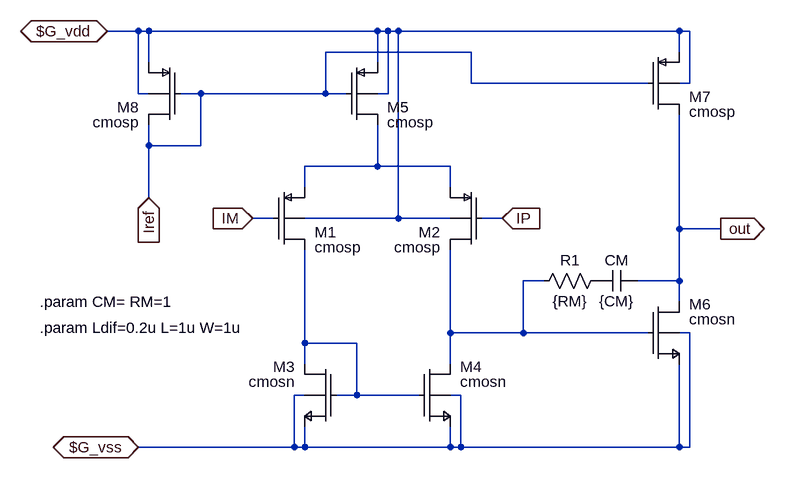
[diagram p0: schematic ao_miler_p.asc]
ao_miler_p.asc, the LTspice schematic file:
Version 4
SHEET 1 880 892
WIRE -400 192 -448 192
WIRE -384 192 -400 192
WIRE -32 192 -384 192
WIRE -16 192 -32 192
WIRE 0 192 -16 192
WIRE 432 192 0 192
WIRE 448 192 432 192
WIRE 112 224 -112 224
WIRE 432 224 432 192
WIRE -384 240 -384 192
WIRE -32 240 -32 192
WIRE 112 272 112 224
WIRE 384 272 112 272
WIRE 448 272 448 192
WIRE 448 272 432 272
WIRE -400 288 -400 192
WIRE -384 288 -400 288
WIRE -304 288 -336 288
WIRE -112 288 -112 224
WIRE -112 288 -304 288
WIRE -80 288 -112 288
WIRE -16 288 -16 192
WIRE -16 288 -32 288
WIRE -384 368 -384 336
WIRE -304 368 -304 288
WIRE -304 368 -384 368
WIRE -32 400 -32 336
WIRE -32 400 -144 400
WIRE 80 400 -32 400
WIRE -144 432 -144 400
WIRE 80 432 80 400
WIRE -384 448 -384 368
WIRE -192 480 -224 480
WIRE 0 480 0 192
WIRE 0 480 -144 480
WIRE 80 480 0 480
WIRE 160 480 128 480
WIRE 432 496 432 320
WIRE 496 496 432 496
WIRE 224 576 192 576
WIRE 432 576 432 496
WIRE 432 576 368 576
WIRE 432 608 432 576
WIRE 80 656 80 528
WIRE 192 656 192 576
WIRE 192 656 80 656
WIRE 384 656 192 656
WIRE 448 656 432 656
WIRE -144 672 -144 528
WIRE -64 672 -144 672
WIRE -144 704 -144 672
WIRE 80 704 80 656
WIRE -144 752 -160 752
WIRE -64 752 -64 672
WIRE -64 752 -96 752
WIRE 32 752 -64 752
WIRE 96 752 80 752
WIRE -160 832 -160 752
WIRE -160 832 -400 832
WIRE -144 832 -144 800
WIRE -144 832 -160 832
WIRE 80 832 80 800
WIRE 80 832 -144 832
WIRE 96 832 96 752
WIRE 96 832 80 832
WIRE 432 832 432 704
WIRE 432 832 96 832
WIRE 448 832 448 656
WIRE 448 832 432 832
FLAG 160 480 IP
IOPIN 160 480 In
FLAG -224 480 IM
IOPIN -224 480 In
FLAG 496 496 out
IOPIN 496 496 Out
FLAG -384 448 Iref
IOPIN -384 448 In
FLAG -400 832 $G_vss
IOPIN -400 832 BiDir
FLAG -448 192 $G_vdd
IOPIN -448 192 BiDir
SYMBOL cap 368 560 R90
WINDOW 0 0 32 VBottom 2
WINDOW 3 32 32 VTop 2
SYMATTR InstName CM
SYMATTR Value {CM}
SYMBOL res 320 560 R90
WINDOW 0 0 56 VBottom 2
WINDOW 3 32 56 VTop 2
SYMATTR InstName R1
SYMATTR Value {RM}
SYMBOL nmosb 384 608 R0
SYMATTR InstName M6
SYMATTR Value cmosn
SYMATTR Value2 l={L} w={W} ad={Ldif*W} as={Ldif*W} pd={(Ldif+W)*2} ps={(Ldif+W)*2} m=1
SYMBOL pmosb 384 224 R0
SYMATTR InstName M7
SYMATTR Value cmosp
SYMATTR Value2 l={L} w={W} ad={Ldif*W} as={Ldif*W} pd={(Ldif+W)*2} ps={(Ldif+W)*2} m=1
SYMBOL pmosb -192 432 R0
SYMATTR InstName M1
SYMATTR Value cmosp
SYMATTR Value2 l={L} w={W} ad={Ldif*W} as={Ldif*W} pd={(Ldif+W)*2} ps={(Ldif+W)*2} m=1
SYMBOL pmosb 128 432 M0
SYMATTR InstName M2
SYMATTR Value cmosp
SYMATTR Value2 l={L} w={W} ad={Ldif*W} as={Ldif*W} pd={(Ldif+W)*2} ps={(Ldif+W)*2} m=1
SYMBOL nmosb -96 704 M0
SYMATTR InstName M3
SYMATTR Value cmosn
SYMATTR Value2 l={L} w={W} ad={Ldif*W} as={Ldif*W} pd={(Ldif+W)*2} ps={(Ldif+W)*2} m=1
SYMBOL nmosb 32 704 R0
SYMATTR InstName M4
SYMATTR Value cmosn
SYMATTR Value2 l={L} w={W} ad={Ldif*W} as={Ldif*W} pd={(Ldif+W)*2} ps={(Ldif+W)*2} m=1
SYMBOL pmosb -80 240 R0
SYMATTR InstName M5
SYMATTR Value cmosp
SYMATTR Value2 l={L} w={W} ad={Ldif*W} as={Ldif*W} pd={(Ldif+W)*2} ps={(Ldif+W)*2} m=1
SYMBOL pmosb -336 240 M0
SYMATTR InstName M8
SYMATTR Value cmosp
SYMATTR Value2 l={L} w={W} ad={Ldif*W} as={Ldif*W} pd={(Ldif+W)*2} ps={(Ldif+W)*2} m=1
TEXT -552 648 Left 2 !.param Ldif=0.2u L=1u W=1u
TEXT -552 608 Left 2 !.param CM= RM=1

The netlist it stands for:
* ao_miler_p.asc
CM out P001 {CM}
R1 P001 N002 {RM}
M6 out N002 $G_vss $G_vss cmosn l={L} w={W} ad={Ldif*W} as={Ldif*W} pd={(Ldif+W)*2} ps={(Ldif+W)*2} m=1
M7 out Iref $G_vdd $G_vdd cmosp l={L} w={W} ad={Ldif*W} as={Ldif*W} pd={(Ldif+W)*2} ps={(Ldif+W)*2} m=1
M1 N003 IM N001 $G_vdd cmosp l={L} w={W} ad={Ldif*W} as={Ldif*W} pd={(Ldif+W)*2} ps={(Ldif+W)*2} m=1
M2 N002 IP N001 $G_vdd cmosp l={L} w={W} ad={Ldif*W} as={Ldif*W} pd={(Ldif+W)*2} ps={(Ldif+W)*2} m=1
M3 N003 N003 $G_vss $G_vss cmosn l={L} w={W} ad={Ldif*W} as={Ldif*W} pd={(Ldif+W)*2} ps={(Ldif+W)*2} m=1
M4 N002 N003 $G_vss $G_vss cmosn l={L} w={W} ad={Ldif*W} as={Ldif*W} pd={(Ldif+W)*2} ps={(Ldif+W)*2} m=1
M5 N001 Iref $G_vdd $G_vdd cmosp l={L} w={W} ad={Ldif*W} as={Ldif*W} pd={(Ldif+W)*2} ps={(Ldif+W)*2} m=1
M8 Iref Iref $G_vdd $G_vdd cmosp l={L} w={W} ad={Ldif*W} as={Ldif*W} pd={(Ldif+W)*2} ps={(Ldif+W)*2} m=1
.model NMOS NMOS
.model PMOS PMOS
.lib standard.mos
.param Ldif=0.2u L=1u W=1u
.param CM= RM=1
.backanno
.end